# EAGLE schematic boilerplate (EAGLE 9.5.0)
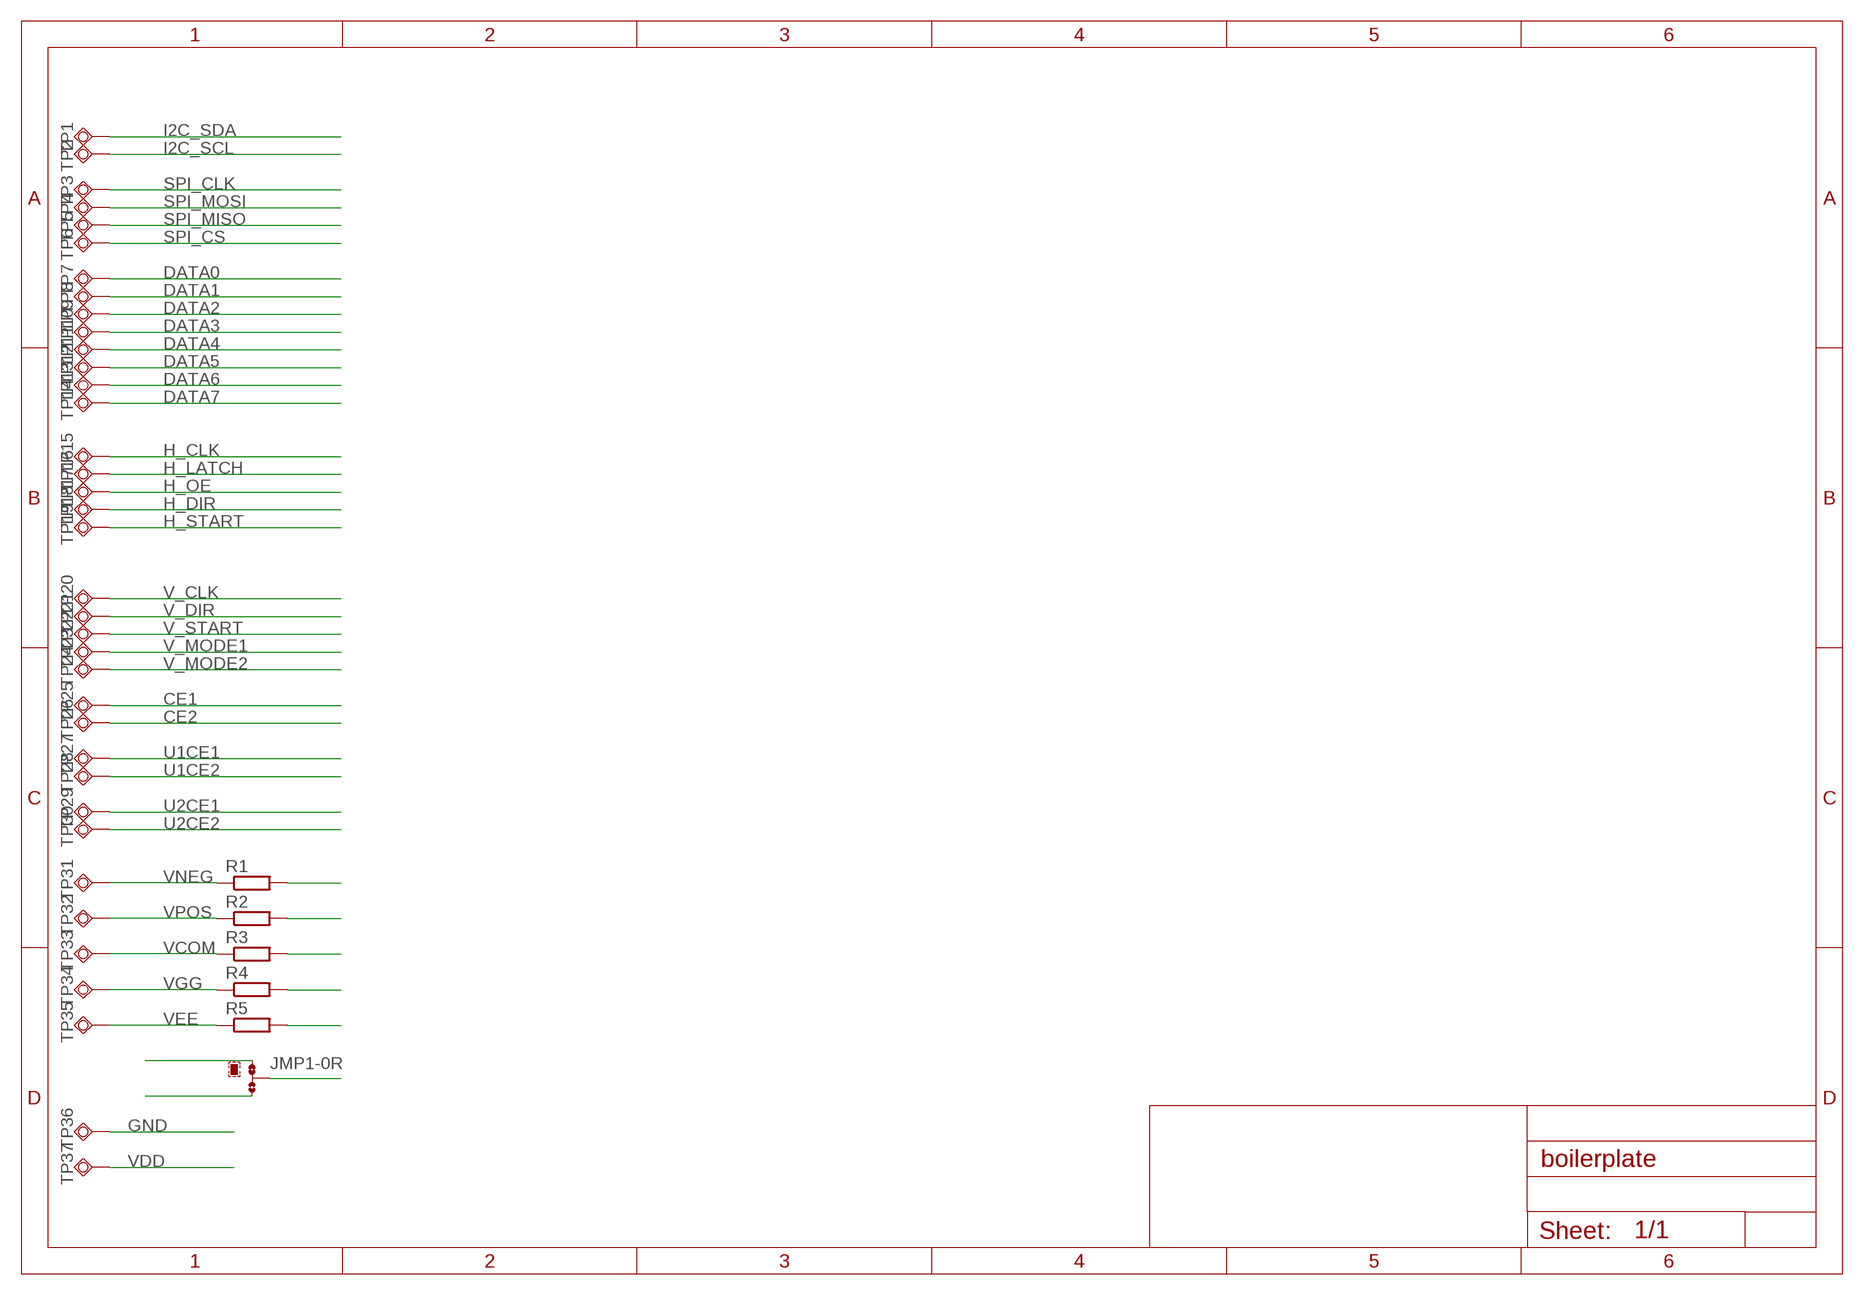
[diagram p0: schematic, sheet 1]

## Parts
JMP1  0R-JUMPA  [A0R-JMP]
R1  R-EU_R0805  [R0805]
R2  R-EU_R0805  [R0805]
R3  R-EU_R0805  [R0805]
R4  R-EU_R0805  [R0805]
R5  R-EU_R0805  [R0805]
TP1  TESTPAD0.6  [VIA0.6]
TP2  TESTPAD0.6  [VIA0.6]
TP3  TESTPAD0.6  [VIA0.6]
TP4  TESTPAD0.6  [VIA0.6]
TP5  TESTPAD0.6  [VIA0.6]
TP6  TESTPAD0.6  [VIA0.6]
TP7  TESTPAD0.6  [VIA0.6]
TP8  TESTPAD0.6  [VIA0.6]
TP9  TESTPAD0.6  [VIA0.6]
TP10  TESTPAD0.6  [VIA0.6]
TP11  TESTPAD0.6  [VIA0.6]
TP12  TESTPAD0.6  [VIA0.6]
TP13  TESTPAD0.6  [VIA0.6]
TP14  TESTPAD0.6  [VIA0.6]
TP15  TESTPAD0.6  [VIA0.6]
TP16  TESTPAD0.6  [VIA0.6]
TP17  TESTPAD0.6  [VIA0.6]
TP18  TESTPAD0.6  [VIA0.6]
TP19  TESTPAD0.6  [VIA0.6]
TP20  TESTPAD0.6  [VIA0.6]
TP21  TESTPAD0.6  [VIA0.6]
TP22  TESTPAD0.6  [VIA0.6]
TP23  TESTPAD0.6  [VIA0.6]
TP24  TESTPAD0.6  [VIA0.6]
TP25  TESTPAD0.6  [VIA0.6]
TP26  TESTPAD0.6  [VIA0.6]
TP27  TESTPAD0.6  [VIA0.6]
TP28  TESTPAD0.6  [VIA0.6]
TP29  TESTPAD0.6  [VIA0.6]
TP30  TESTPAD0.6  [VIA0.6]
TP31  TESTPAD0.6  [VIA0.6]
TP32  TESTPAD0.6  [VIA0.6]
TP33  TESTPAD0.6  [VIA0.6]
TP34  TESTPAD0.6  [VIA0.6]
TP35  TESTPAD0.6  [VIA0.6]
TP36  TESTPAD0.6  [VIA0.6]
TP37  TESTPAD0.6  [VIA0.6]

## Nets
CE1: TP25.P$1(TP)
CE2: TP26.P$1(TP)
DATA0: TP7.P$1(TP)
DATA1: TP8.P$1(TP)
DATA2: TP9.P$1(TP)
DATA3: TP10.P$1(TP)
DATA4: TP11.P$1(TP)
DATA5: TP12.P$1(TP)
DATA6: TP13.P$1(TP)
DATA7: TP14.P$1(TP)
GND: TP36.P$1(TP)
H_CLK: TP15.P$1(TP)
H_DIR: TP18.P$1(TP)
H_LATCH: TP16.P$1(TP)
H_OE: TP17.P$1(TP)
H_START: TP19.P$1(TP)
I2C_SCL: TP2.P$1(TP)
I2C_SDA: TP1.P$1(TP)
N$1: JMP1.2
N$2: JMP1.1
N$3: JMP1.3
N$6: R1.2
N$7: R2.2
N$8: R3.2
N$9: R4.2
N$10: R5.2
SPI_CLK: TP3.P$1(TP)
SPI_CS: TP6.P$1(TP)
SPI_MISO: TP5.P$1(TP)
SPI_MOSI: TP4.P$1(TP)
U1CE1: TP27.P$1(TP)
U1CE2: TP28.P$1(TP)
U2CE1: TP29.P$1(TP)
U2CE2: TP30.P$1(TP)
V_CLK: TP20.P$1(TP)
V_DIR: TP21.P$1(TP)
V_MODE1: TP23.P$1(TP)
V_MODE2: TP24.P$1(TP)
V_START: TP22.P$1(TP)
VCOM: R3.1 TP33.P$1(TP)
VDD: TP37.P$1(TP)
VEE: R5.1 TP35.P$1(TP)
VGG: R4.1 TP34.P$1(TP)
VNEG: R1.1 TP31.P$1(TP)
VPOS: R2.1 TP32.P$1(TP)

## Library data of the parts
JMP1 = jump-0r-smd:0R-JUMP: SMD 0R 0805 Jumper
R1-R5 = rcl:R-EU_: RESISTOR, European symbol; SPICEPREFIX: R
TP1-TP37 = parts-passives:TESTPAD